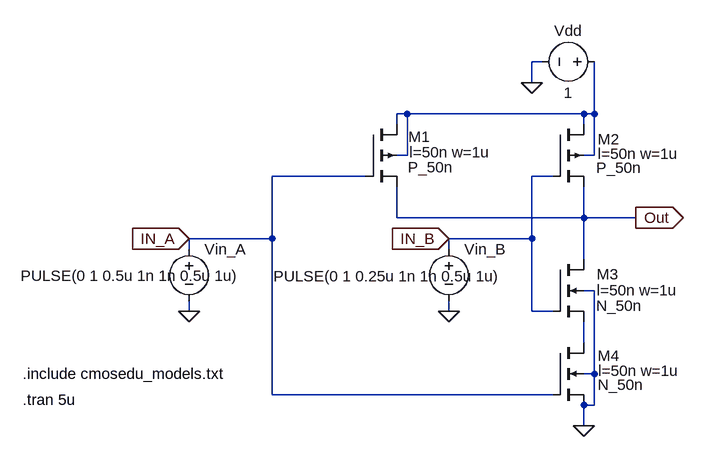
[diagram p0: schematic Draft1.asc]
Draft1.asc, the LTspice schematic file:
Version 4
SHEET 1 880 680
WIRE 448 -160 432 -160
WIRE 432 -128 432 -160
WIRE 240 -80 224 -80
WIRE 512 -80 240 -80
WIRE 528 -80 528 -160
WIRE 528 -80 512 -80
WIRE 224 -64 224 -80
WIRE 512 -64 512 -80
WIRE 240 -16 240 -80
WIRE 240 -16 224 -16
WIRE 528 -16 528 -80
WIRE 528 -16 512 -16
WIRE 176 16 32 16
WIRE 464 16 432 16
WIRE 224 80 224 32
WIRE 512 80 512 32
WIRE 512 80 224 80
WIRE 592 80 512 80
WIRE 32 112 32 16
WIRE 32 112 -96 112
WIRE 432 112 432 16
WIRE 432 112 304 112
WIRE -96 128 -96 112
WIRE 304 128 304 112
WIRE 512 144 512 80
WIRE 528 192 512 192
WIRE -96 224 -96 208
WIRE 304 224 304 208
WIRE 432 224 432 112
WIRE 464 224 432 224
WIRE 512 272 512 240
WIRE 528 320 528 192
WIRE 528 320 512 320
WIRE 32 352 32 112
WIRE 464 352 32 352
WIRE 528 368 528 320
WIRE 528 368 512 368
WIRE 512 400 512 368
FLAG 512 400 0
FLAG 432 -128 0
FLAG -96 224 0
FLAG 304 224 0
FLAG 592 80 Out
IOPIN 592 80 Out
FLAG -96 112 IN_A
IOPIN -96 112 In
FLAG 304 112 IN_B
IOPIN 304 112 In
SYMBOL voltage 544 -160 R90
WINDOW 0 -32 56 VBottom 2
WINDOW 3 32 56 VTop 2
WINDOW 123 0 0 Left 0
WINDOW 39 0 0 Left 0
SYMATTR InstName Vdd
SYMATTR Value 1
SYMBOL voltage 304 112 R0
WINDOW 3 -270 58 Left 2
WINDOW 123 0 0 Left 0
WINDOW 39 0 0 Left 0
SYMATTR Value PULSE(0 1 0.25u 1n 1n 0.5u 1u)
SYMATTR InstName Vin_B
SYMBOL voltage -96 112 R0
WINDOW 3 -259 57 Left 2
WINDOW 123 0 0 Left 0
WINDOW 39 0 0 Left 0
SYMATTR Value PULSE(0 1 0.5u 1n 1n 0.5u 1u)
SYMATTR InstName Vin_A
SYMBOL nmos4 464 272 R0
WINDOW 123 70 43 Left 2
WINDOW 0 69 20 Left 2
WINDOW 3 69 65 Left 2
SYMATTR Value2 l=50n w=1u
SYMATTR InstName M4
SYMATTR Value N_50n
SYMBOL nmos4 464 144 R0
WINDOW 123 68 47 Left 2
WINDOW 0 68 23 Left 2
WINDOW 3 67 71 Left 2
SYMATTR Value2 l=50n w=1u
SYMATTR InstName M3
SYMATTR Value N_50n
SYMBOL pmos4 176 -64 R0
WINDOW 123 67 43 Left 2
WINDOW 0 66 19 Left 2
WINDOW 3 65 66 Left 2
SYMATTR Value2 l=50n w=1u
SYMATTR InstName M1
SYMATTR Value P_50n
SYMBOL pmos4 464 -64 R0
WINDOW 123 69 45 Left 2
WINDOW 0 69 23 Left 2
WINDOW 3 67 67 Left 2
SYMATTR Value2 l=50n w=1u
SYMATTR InstName M2
SYMATTR Value P_50n
TEXT -352 320 Left 2 !.include cmosedu_models.txt
TEXT -352 360 Left 2 !.tran 5u

The netlist it stands for:
* Draft1.asc
Vdd N001 0 1
Vin_B IN_B 0 PULSE(0 1 0.25u 1n 1n 0.5u 1u)
Vin_A IN_A 0 PULSE(0 1 0.5u 1n 1n 0.5u 1u)
M4 N002 IN_A 0 0 N_50n l=50n w=1u
M3 Out IN_B N002 0 N_50n l=50n w=1u
M1 N001 IN_A Out N001 P_50n l=50n w=1u
M2 N001 IN_B Out N001 P_50n l=50n w=1u
.model NMOS NMOS
.model PMOS PMOS
.lib standard.mos
.include cmosedu_models.txt
.tran 5u
.backanno
.end